# Altium schematic sheet serial.SchDoc
size A4; Organization: Altium Limited; Address1: L3, 12a Rodborough Rd; Address2: Frenchs Forest; Address3: NSW; Address4: Australia 2086; DocumentNumber: 6; SheetNumber: 6; SheetTotal: 6
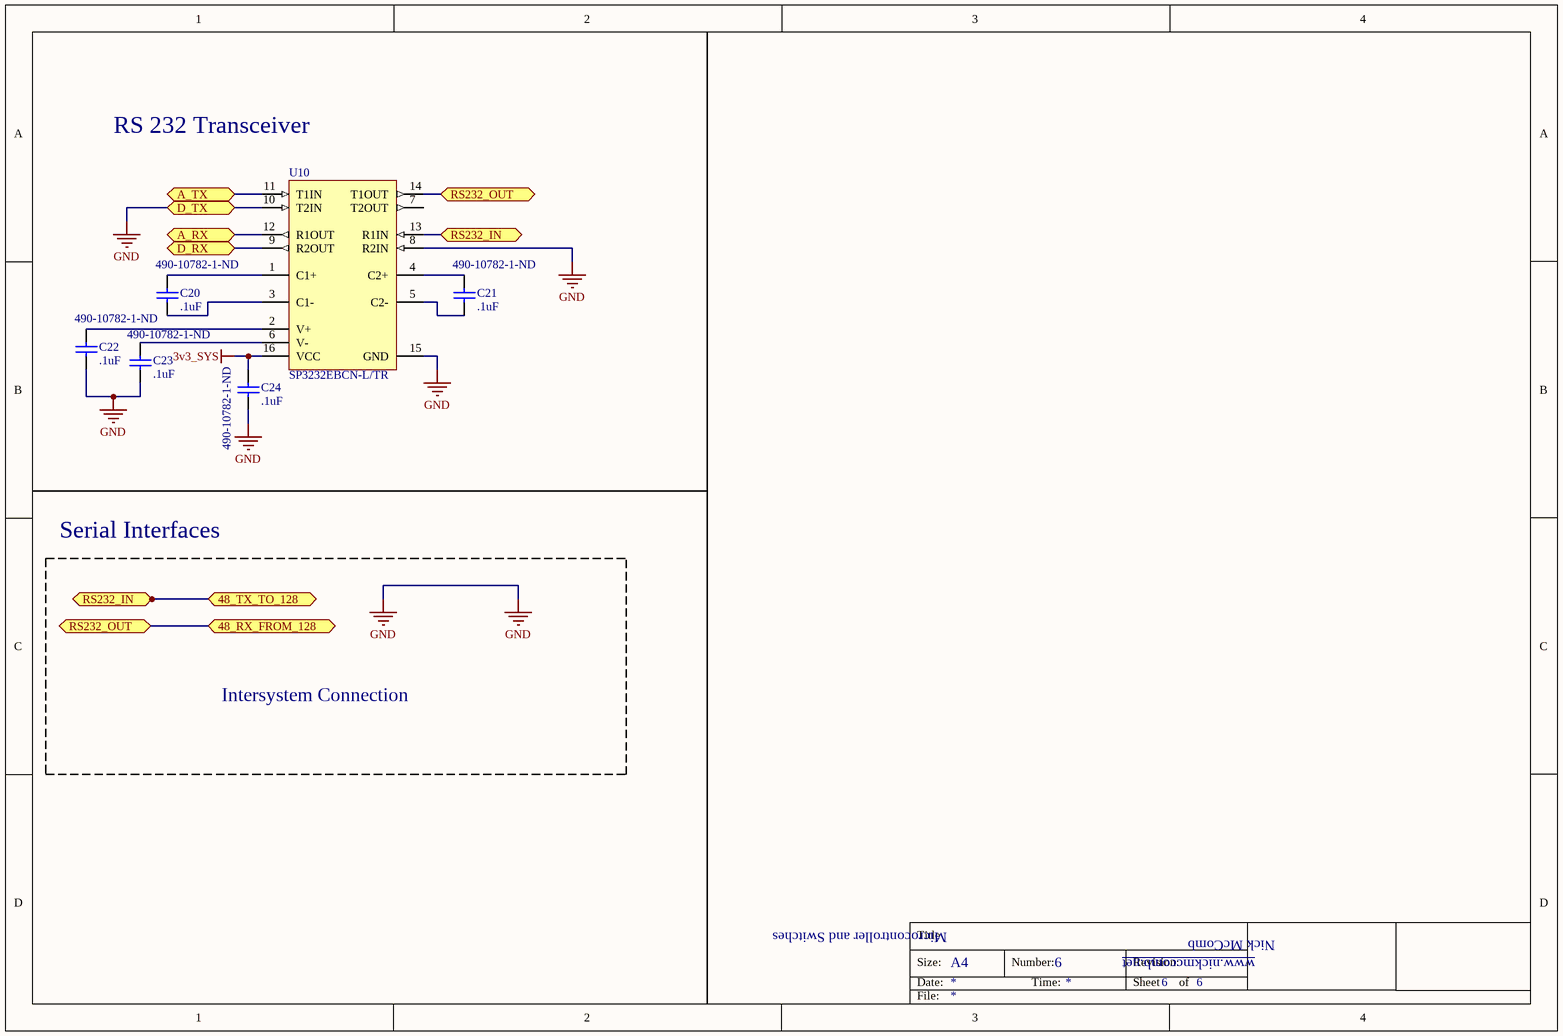
[diagram p0: serial.SchDoc]

## Parts
C20  value .1uF  Supplier Part Number 1: 490-10782-1-ND  [C0805]  (hidden comment: 0805 style, by default)
C21  value .1uF  Supplier Part Number 1: 490-10782-1-ND  [C0805]  (hidden comment: 0805 style, by default)
C22  value .1uF  Supplier Part Number 1: 490-10782-1-ND  [C0805]  (hidden comment: 0805 style, by default)
C23  value .1uF  Supplier Part Number 1: 490-10782-1-ND  [C0805]  (hidden comment: 0805 style, by default)
C24  value .1uF  Supplier Part Number 1: 490-10782-1-ND  [C0805]  (hidden comment: 0805 style, by default)
U10  SP3232EBCN-L/TR  [EXAR-NSOIC-16_N]

## Ports
48_RX_FROM_128, 48_TX_TO_128, A_RX, A_TX, D_RX, D_TX, RS232_IN, RS232_OUT

## Nets
3v3_SYS: C24.2 U10.16(VCC)
GND: C22.1 C23.1 C24.1 U10.8(R2IN) U10.10(T2IN) U10.15(GND) ; port D_TX
48_RX_FROM_128: U10.14(T1OUT) ; port RS232_OUT, port 48_RX_FROM_128
48_TX_TO_128: U10.13(R1IN) ; port RS232_IN, port 48_TX_TO_128
A_RX: U10.12(R1OUT) ; port A_RX
A_TX: U10.11(T1IN) ; port A_TX
D_RX: U10.9(R2OUT) ; port D_RX
NetC20_1: C20.1 U10.3(C1-)
NetC20_2: C20.2 U10.1(C1+)
NetC21_1: C21.1 U10.5(C2-)
NetC21_2: C21.2 U10.4(C2+)
NetC22_2: C22.2 U10.2(V+)
NetC23_2: C23.2 U10.6(V-)

Not connected (* = marked no-connect by the designer): U10 7(T2OUT)

## Notes on the sheet
- RS 232 Transceiver
- Serial Interfaces
- Intersystem Connection
- Microcontroller and Switches
- Title
- Size:
- Date:
- A4
- Number:
- Time:
- Revision:
- Sheet
- of
- www.nickmccomb.net
- Nick McComb
- File:

## Library data of the parts
C20-C24 = Cap: Capacitor; Manufacturer: Murata Electronics North America; Manufacturer Part Number: GRM21BR71H104JA01L; Capacitance: 0.10µF; Tolerance: ±5%; Voltage - Rated: 50V; Temperature Coefficient: X7R; Published: 8-Jun-2000; LatestRevisionDate: 17-Jul-2002; LatestRevisionNote: Re-released for DXP Platform.; PackageReference: RAD-0.3; Publisher: Altium Limited; PackageDescription: Radial Cap, Thru-Hole; 2 Leads; 0.3 in Pin Spacing; Supplier 1: Digi-Key; RoHS: RoHS Compliant; Category: Capacitors; Stock 1: 17503; Pricing 1: 1=0.16, 10=0.113, 50=0.065, 100=0.0537, 250=0.0452, 500=0.03786, 1000=0.03108 (USD); Packaging: Cut Tape (CT); Mounting Type: Surface Mount, MLCC; Operating Temperature: -55°C ~ 125°C; Applications: General Purpose; Ratings: -; Package / Case: 0805 (2012 Metric); Size / Dimension: 0.079" L x 0.049" W (2.00mm x 1.25mm); Height - Seated (Max): -; Thickness (Max): 0.053" (1.35mm); Lead Spacing: -; Features: -; Lead Style: -; ComponentLink1URL: http://www.murata.com/~/media/webrenewal/support/library/catalog/products/capacitor/mlcc/c02e.pdf; ComponentLink1Description: http://www.murata.com/~/media/webrenewal/support/library/catalog/products/capacitor/mlcc/c02e.pdf
U10 = CMP-0935-00001-1: RS-232 Transceiver with 2-Drivers / 2-Receivers, 3 to 5.5 V, 250 Kbps, 16-Pin NSOIC, 0 to 70 degC, Pb-free, Tape and Reel; Manufacturer: Exar Corporation; No. of Tx: 2; ESD: 15 KV; ComponentLink1URL: http://www.exar.com/; ComponentLink1Description: Manufacturer URL; PackageDescription: 16-Pin Small Outline Integrated Circuit, Body 9.9 x 3.9 mm, Pitch 1.27 mm; Data Rate: 250 Kbps; No. of Rx: 2; DatasheetVersion: Rev. 1.0.2; Packing: Tape and Reel; PartNumber: SP3232EBCN-L/TR; Temp. Range: 0 to 70 degC; VCC: 3 to 5.5 V; ComponentLink2Description: Datasheet; PackageReference: NSOIC-16; Mounting Technology: Surface Mount; ComponentLink2URL: https://www.exar.com/common/content/document.ashx?id=632&languageid=1033